# EAGLE design Team18_V1.3 (EAGLE 9.3.0)
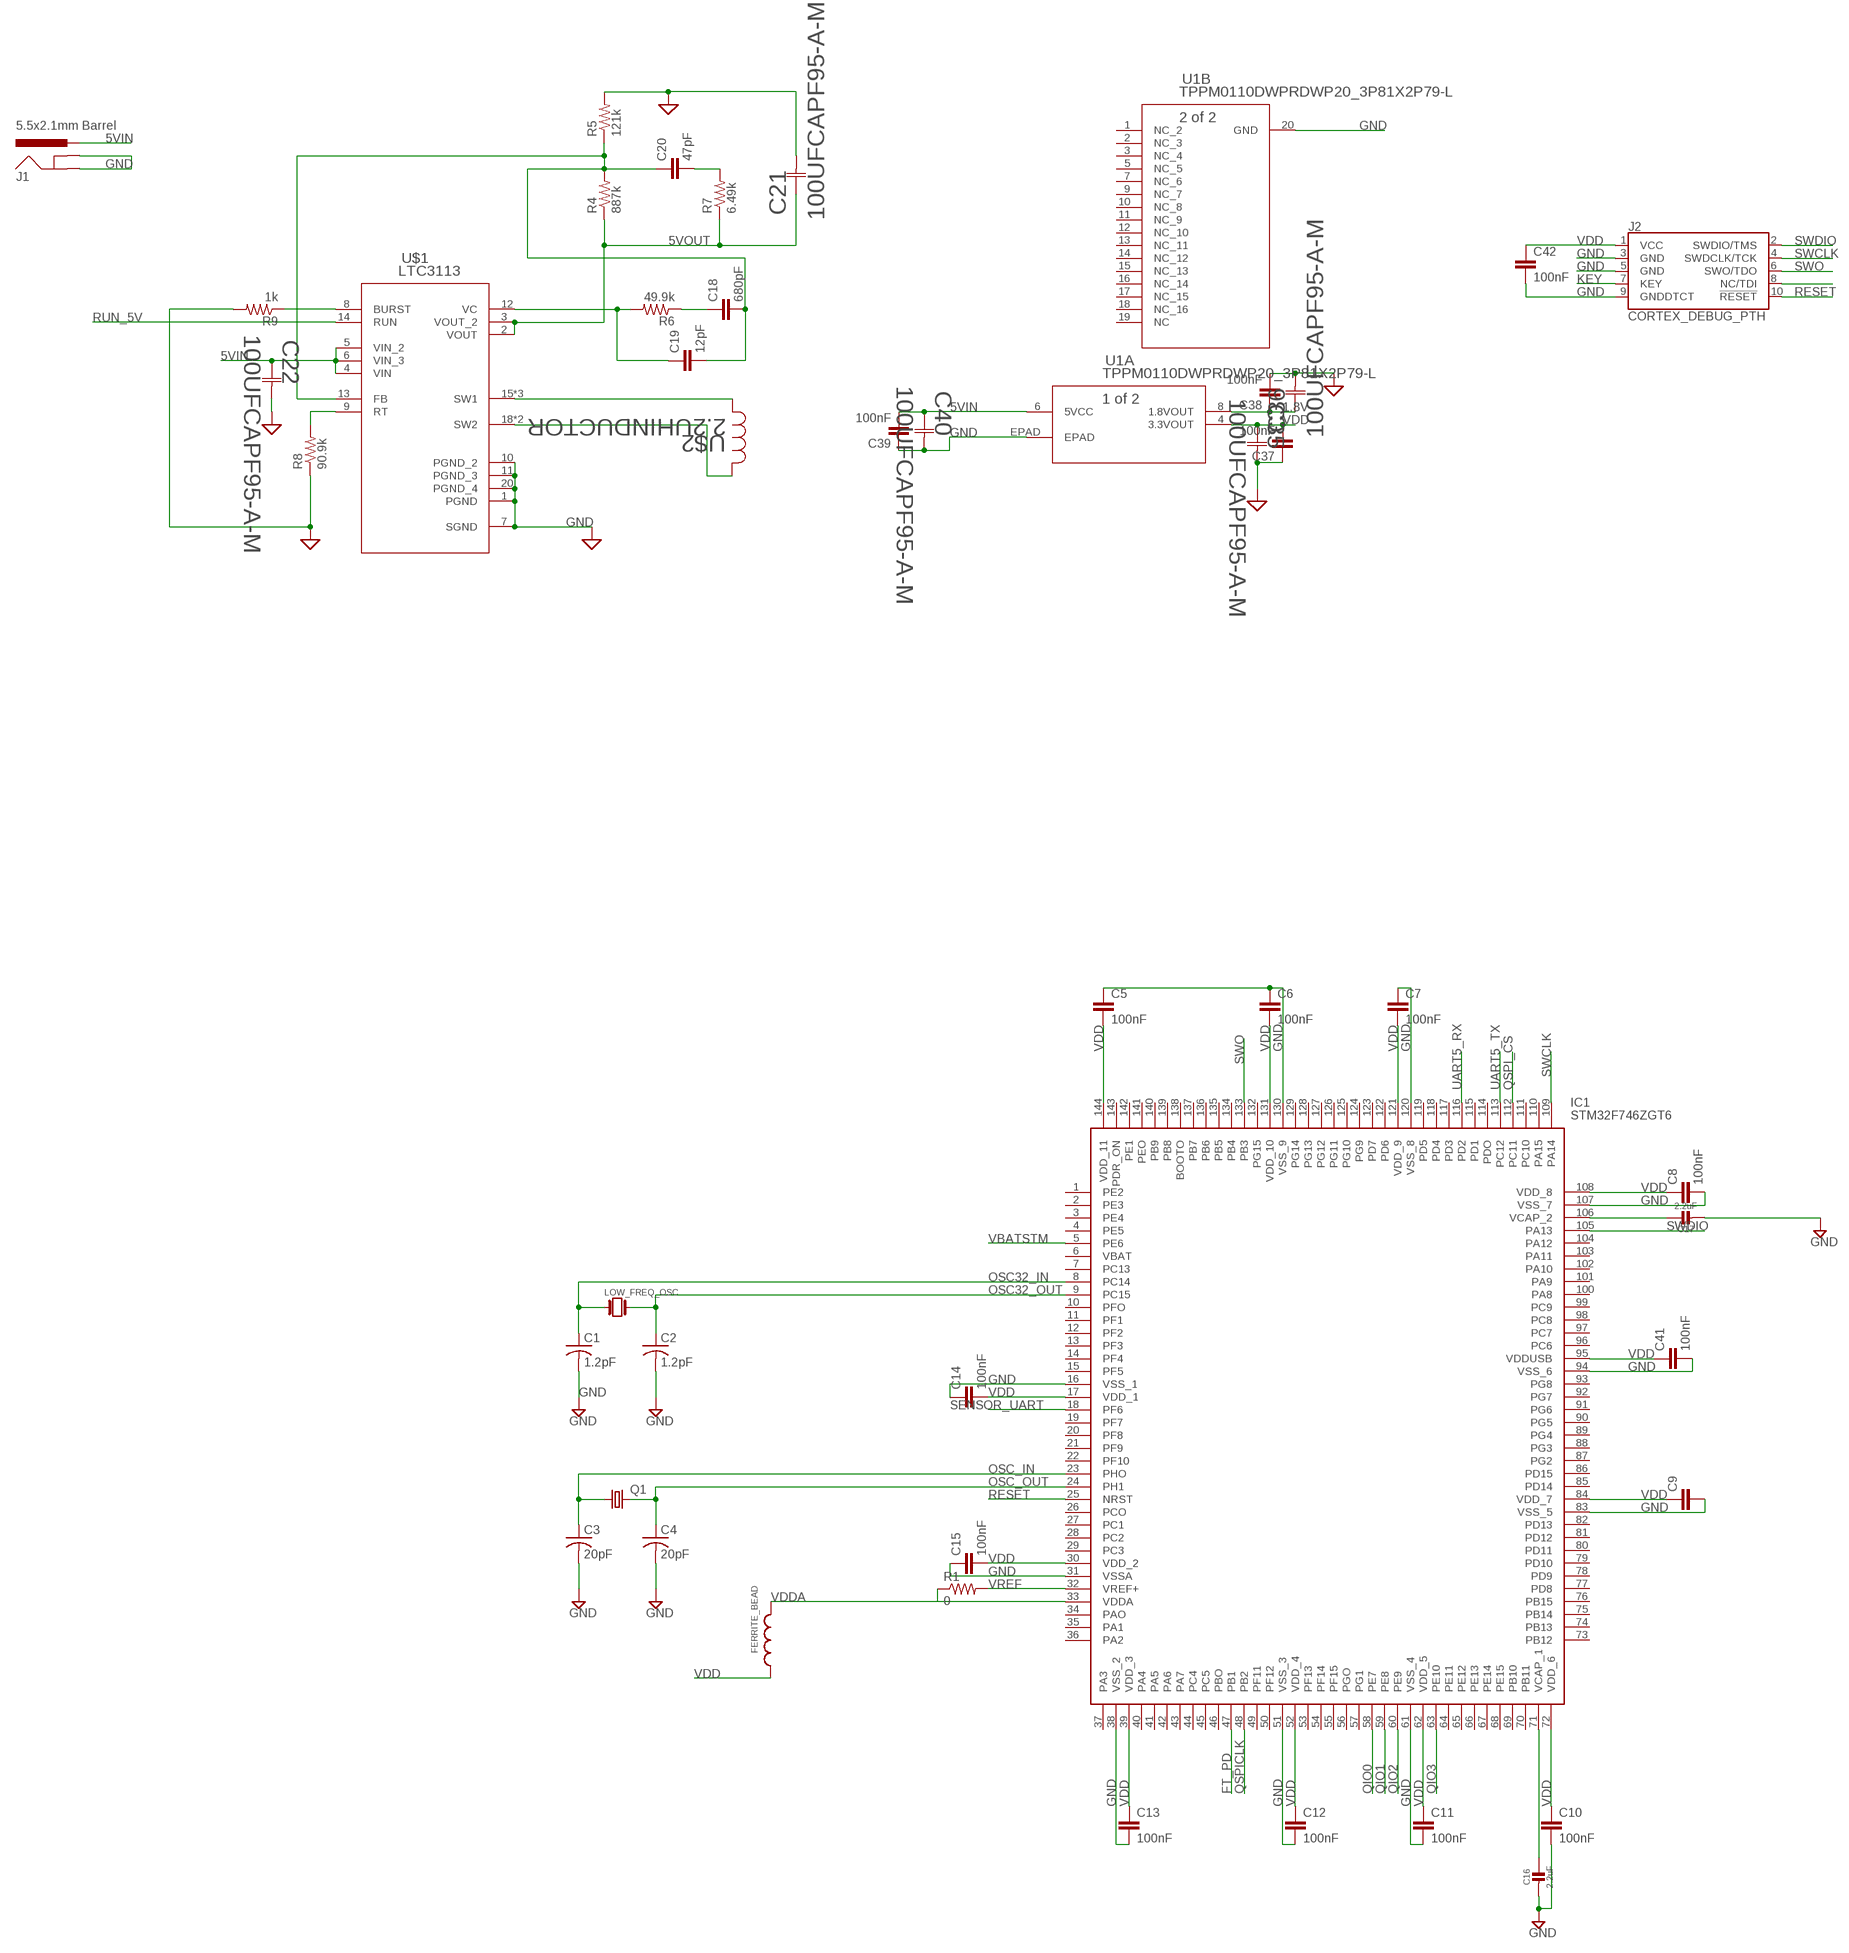
[diagram p0: schematic, sheet 1, part 1 of 2]
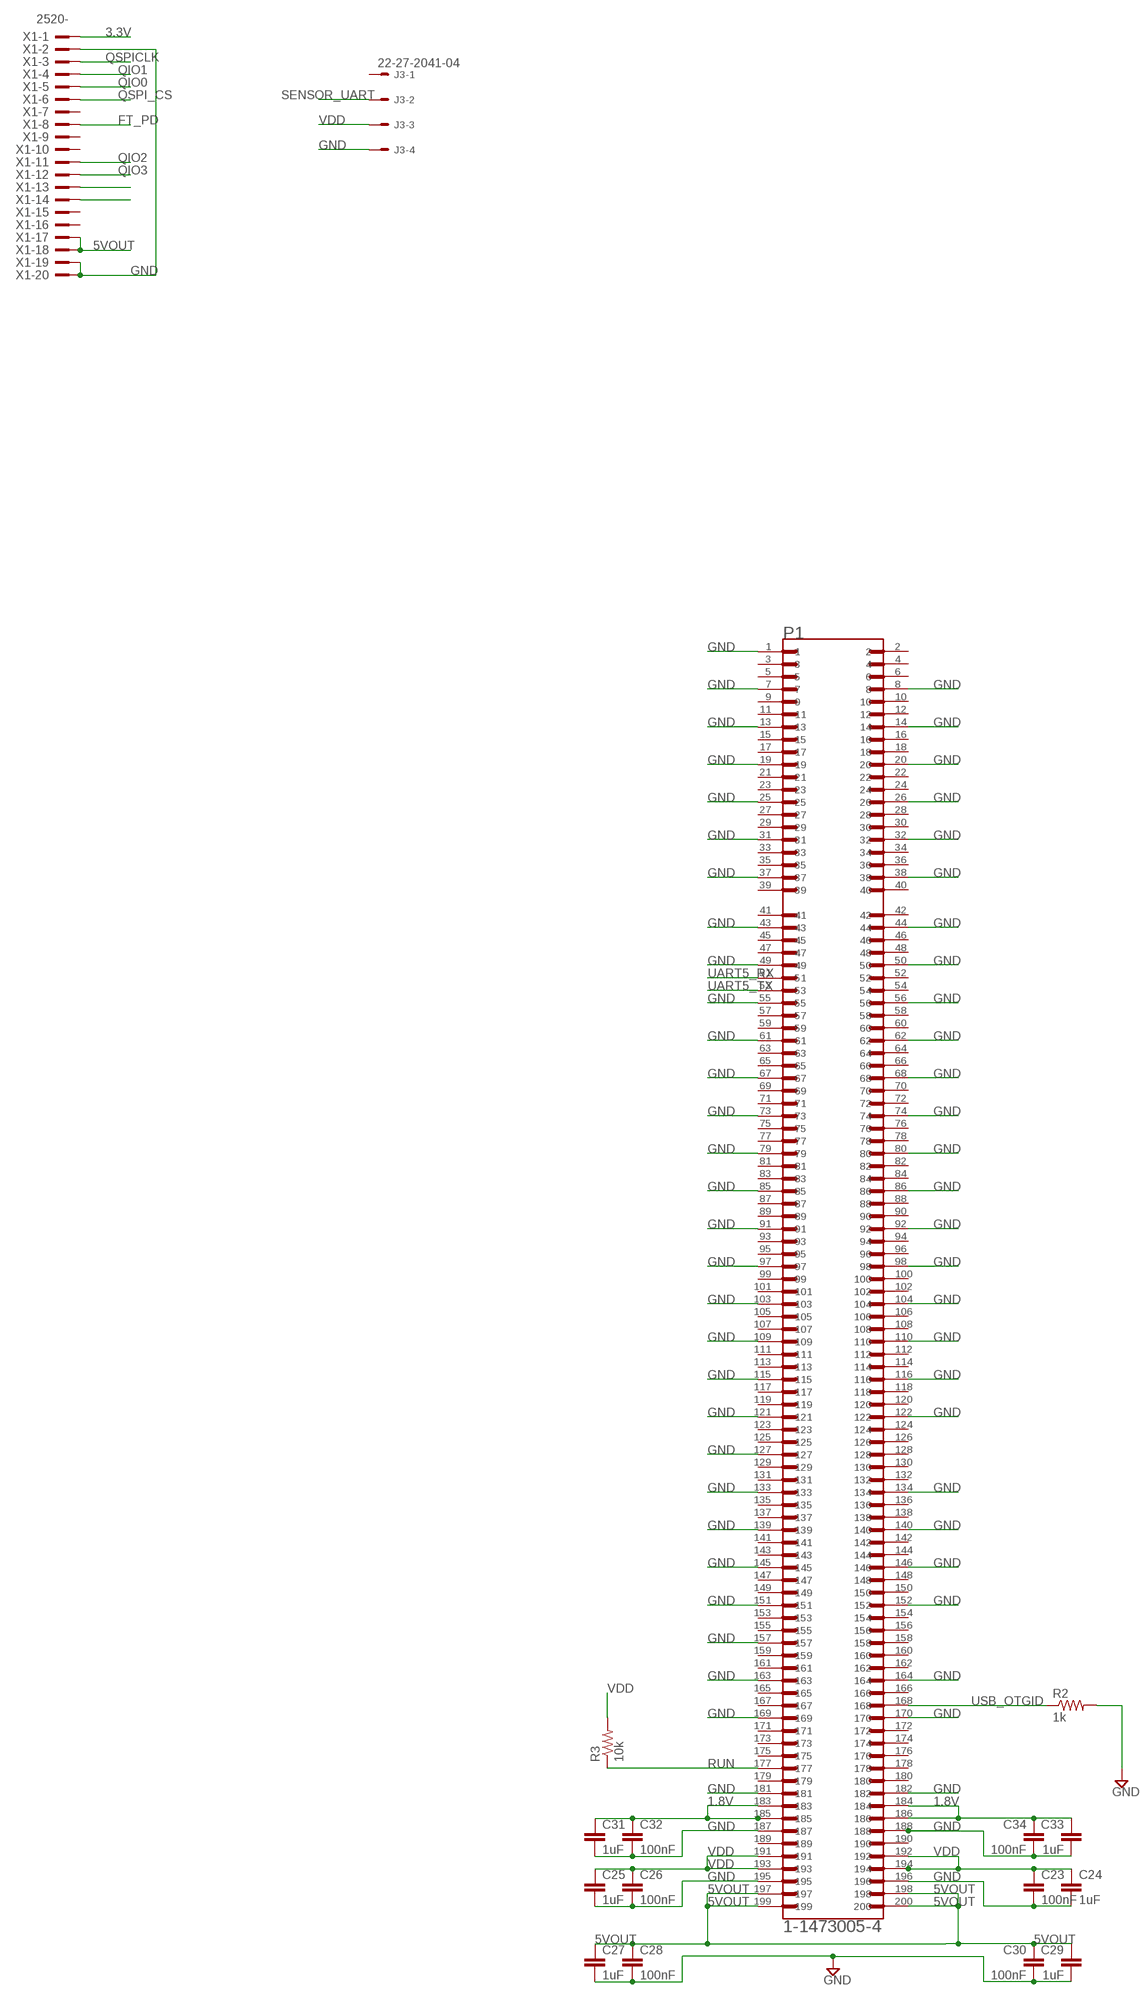
[diagram p1: schematic, sheet 1, part 2 of 2]

## Parts
C1  1.2pF  C-USC0805  [C0805]
C2  1.2pF  C-USC0805  [C0805]
C3  20pF  C-USC0805  [C0805]
C4  20pF  C-USC0805  [C0805]
C5  100nF  C-EUC0805  [C0805]
C6  100nF  C-EUC0805  [C0805]
C7  100nF  C-EUC0805  [C0805]
C8  100nF  C-EUC0805  [C0805]
C9  C-EUC0805  [C0805]
C10  100nF  C-EUC0805  [C0805]
C11  100nF  C-EUC0805  [C0805]
C12  100nF  C-EUC0805  [C0805]
C13  100nF  C-EUC0805  [C0805]
C14  100nF  C-EUC0805  [C0805]
C15  100nF  C-EUC0805  [C0805]
C16  2.2uF  CAP_CERAMIC0805-NOOUTLINE  [0805-NO]
C17  2.2uF  CAP_CERAMIC0805-NOOUTLINE  [0805-NO]
C18  680pF  C-EUC0805  [C0805]
C19  12pF  C-EUC0805  [C0805]
C20  47pF  C-EUC0805  [C0805]
C21  100UFCAPF95-A-M  [F95-A-M]
C22  100UFCAPF95-A-M  [F95-A-M]
C23  100nF  C-EUC0805  [C0805]
C24  1uF  C-EUC0805  [C0805]
C25  1uF  C-EUC0805  [C0805]
C26  100nF  C-EUC0805  [C0805]
C27  1uF  C-EUC0805  [C0805]
C28  100nF  C-EUC0805  [C0805]
C29  1uF  C-EUC0805  [C0805]
C30  100nF  C-EUC0805  [C0805]
C31  1uF  C-EUC0805  [C0805]
C32  100nF  C-EUC0805  [C0805]
C33  1uF  C-EUC0805  [C0805]
C34  100nF  C-EUC0805  [C0805]
C35  100UFCAPF95-A-M  [F95-A-M]
C36  100UFCAPF95-A-M  [F95-A-M]
C37  100nF  C-EUC0805  [C0805]
C38  100nF  C-EUC0805  [C0805]
C39  100nF  C-EUC0805  [C0805]
C40  100UFCAPF95-A-M  [F95-A-M]
C41  100nF  C-EUC0805  [C0805]
C42  100nF  C-EUC0805  [C0805]
FERRITE_BEAD  WE-CBA_0805_782853112_HC  [WE-CBA_0805(W=4)]
IC1  STM32F746ZGT6  [QFP50P2200X2200X160-144N]
J1  5.5x2.1mm Barrel  POWER_JACKSMD  [POWER_JACK_SMD]
J2  CORTEX_DEBUG_PTH  [2X5-PTH-1.27MM]
J3  22-27-2041-04  [6410-04]
LOW_FREQ_OSC  GENERIC-CRYSTAL_FC135  [FC135]
P1  1-1473005-4  [TE_1-1473005-4]
Q1  CRYSTALHC49UP  [HC49UP]
R1  0  R-US_R0805  [R0805]
R2  1k  R-US_R0805  [R0805]
R3  10k  R-US_R0805  [R0805]
R4  887k  R-US_R0805  [R0805]
R5  121k  R-US_R0805  [R0805]
R6  49.9k  R-US_R0805  [R0805]
R7  6.49k  R-US_R0805  [R0805]
R8  90.9k  R-US_R0805  [R0805]
R9  1k  R-US_R0805  [R0805]
U1  TPPM0110DWPRDWP20_3P81X2P79-L  [DWP20_3P81X2P79-L]
U$1  LTC3113  [TSSOP-20_FE/CA]
U$2  2.2UHINDUCTOR  [IND_10040]
X1  2520-  [PAK100/2500-20]

## Nets
1.8V: C31.1 C32.1 C33.1 C34.1 C36.1 C38.1 P1.183 P1.184 P1.185 P1.186 U1.8(A:1.8VOUT)
3.3V: X1.1
5VIN: C22.1 C39.2 C40.1 J1.VIN0(PWR) U1.6(A:5VCC) U$1.4(VIN) U$1.5(VIN_2) U$1.6(VIN_3)
5VOUT: C21.1 C27.1 C28.1 C29.1 C30.1 P1.197 P1.198 P1.199 P1.200 R4.1 R7.1 U$1.2(VOUT) U$1.3(VOUT_2) X1.17 X1.18
FT_PD: IC1.47(PB1) X1.8
GND: C1.2 C2.2 C3.2 C4.2 C5.1 C6.1 C7.1 C8.2 C9.2 C10.2 C11.2 C12.2 C13.2 C14.1 C15.1 C16.2 C17.2 C21.2 C22.2 C23.2 C24.2 C25.2 C26.2 C27.2 C28.2 C29.2 C30.2 C31.2 C32.2 C33.2 C34.2 C35.2 C36.2 C37.1 C38.2 C39.1 C40.2 C41.2 C42.2 IC1.16(VSS_1) IC1.31(VSSA) IC1.38(VSS_2) IC1.51(VSS_3) IC1.61(VSS_4) IC1.83(VSS_5) IC1.94(VSS_6) IC1.107(VSS_7) IC1.120(VSS_8) IC1.130(VSS_9) J1.GND(GNDBREAK) J1.P$4(GND) J2.3(GND) J2.5(GND) J2.9(GNDDTCT) J3.4 P1.1 P1.7 P1.8 P1.13 P1.14 P1.19 P1.20 P1.25 P1.26 P1.31 P1.32 P1.37 P1.38 P1.43 P1.44 P1.49 P1.50 P1.55 P1.56 P1.61 P1.62 P1.67 P1.68 P1.73 P1.74 P1.79 P1.80 P1.85 P1.86 P1.91 P1.92 P1.97 P1.98 P1.103 P1.104 P1.109 P1.110 P1.115 P1.116 P1.121 P1.122 P1.127 P1.133 P1.134 P1.139 P1.140 P1.145 P1.146 P1.151 P1.152 P1.157 P1.163 P1.164 P1.169 P1.170 P1.181 P1.182 P1.187 P1.188 P1.195 P1.196 R2.2 R5.2 R8.1 R9.2 U1.20(B:GND) U1.EPAD(A:EPAD) U$1.1(PGND) U$1.7(SGND) U$1.10(PGND_2) U$1.11(PGND_3) U$1.20(PGND_4) X1.2 X1.19 X1.20 ; supply symbol labelled SUP
KEY: J2.7(KEY)
N$1: C16.1 IC1.71(VCAP_1)
N$2: C17.1 IC1.106(VCAP_2)
N$3: C20.2 R7.2
N$4: C19.1 R6.2 U$1.12(VC)
N$5: C18.1 R6.1
N$6: C18.2 C19.2 C20.1 R4.2 R5.1 U$1.13(FB)
N$7: U$1.15(SW1) U$1.16(SW1) U$1.17(SW1) U$2.2
N$8: U$1.18(SW2) U$1.19(SW2) U$2.1
N$9: R8.2 U$1.9(RT)
N$10: R9.1 U$1.8(BURST)
N$19: J2.8(NC/TDI)
N$20: X1.13
N$21: X1.14
OSC32_IN: C1.1 IC1.8(PC14) LOW_FREQ_OSC.X1
OSC32_OUT: C2.1 IC1.9(PC15) LOW_FREQ_OSC.X2
OSC_IN: C3.1 IC1.23(PHO) Q1.1
OSC_OUT: C4.1 IC1.24(PH1) Q1.2
QIO0: IC1.58(PE7) X1.5
QIO1: IC1.59(PE8) X1.4
QIO2: IC1.60(PE9) X1.11
QIO3: IC1.63(PE10) X1.12
QSPI_CS: IC1.112(PC11) X1.6
QSPICLK: IC1.48(PB2) X1.3
RESET: IC1.25(NRST) J2.10(!RESET)
RUN: P1.177 R3.1
RUN_5V: U$1.14(RUN)
SENSOR_UART: IC1.18(PF6) J3.2
SWCLK: IC1.109(PA14) J2.4(SWDCLK/TCK)
SWDIO: IC1.105(PA13) J2.2(SWDIO/TMS)
SWO: IC1.133(PB3) J2.6(SWO/TDO)
UART5_RX: IC1.116(PD2) P1.51
UART5_TX: IC1.113(PC12) P1.53
USB_OTGID: P1.168 R2.1
VBATSTM: IC1.5(PE6)
VDD: C5.2 C6.2 C7.2 C8.1 C9.1 C10.1 C11.1 C12.1 C13.1 C14.2 C15.2 C23.1 C24.1 C25.1 C26.1 C35.1 C37.2 C41.1 C42.1 FERRITE_BEAD.1 IC1.17(VDD_1) IC1.30(VDD_2) IC1.39(VDD_3) IC1.52(VDD_4) IC1.62(VDD_5) IC1.72(VDD_6) IC1.84(VDD_7) IC1.95(VDDUSB) IC1.108(VDD_8) IC1.121(VDD_9) IC1.131(VDD_10) IC1.144(VDD_11) J2.1(VCC) J3.3 P1.191 P1.192 P1.193 P1.194 R3.2 U1.4(A:3.3VOUT)
VDDA: FERRITE_BEAD.2 IC1.33(VDDA) R1.1
VREF: IC1.32(VREF+) R1.2
Unconnected: IC1.1(PE2) IC1.2(PE3) IC1.3(PE4) IC1.4(PE5) IC1.6(VBAT) IC1.7(PC13) IC1.10(PFO) IC1.11(PF1) IC1.12(PF2) IC1.13(PF3) IC1.14(PF4) IC1.15(PF5) IC1.19(PF7) IC1.20(PF8) IC1.21(PF9) IC1.22(PF10) IC1.26(PCO) IC1.27(PC1) IC1.28(PC2) IC1.29(PC3) IC1.34(PAO) IC1.35(PA1) IC1.36(PA2) IC1.37(PA3) IC1.40(PA4) IC1.41(PA5) IC1.42(PA6) IC1.43(PA7) IC1.44(PC4) IC1.45(PC5) IC1.46(PBO) IC1.49(PF11) IC1.50(PF12) IC1.53(PF13) IC1.54(PF14) IC1.55(PF15) IC1.56(PGO) IC1.57(PG1) IC1.64(PE11) IC1.65(PE12) IC1.66(PE13) IC1.67(PE14) IC1.68(PE15) IC1.69(PB10) IC1.70(PB11) IC1.73(PB12) IC1.74(PB13) IC1.75(PB14) IC1.76(PB15) IC1.77(PD8) IC1.78(PD9) IC1.79(PD10) IC1.80(PD11) IC1.81(PD12) IC1.82(PD13) IC1.85(PD14) IC1.86(PD15) IC1.87(PG2) IC1.88(PG3) IC1.89(PG4) IC1.90(PG5) IC1.91(PG6) IC1.92(PG7) IC1.93(PG8) IC1.96(PC6) IC1.97(PC7) IC1.98(PC8) IC1.99(PC9) IC1.100(PA8) IC1.101(PA9) IC1.102(PA10) IC1.103(PA11) IC1.104(PA12) IC1.110(PA15) IC1.111(PC10) IC1.114(PDO) IC1.115(PD1) IC1.117(PD3) IC1.118(PD4) IC1.119(PD5) IC1.122(PD6) IC1.123(PD7) IC1.124(PG9) IC1.125(PG10) IC1.126(PG11) IC1.127(PG12) IC1.128(PG13) IC1.129(PG14) IC1.132(PG15) IC1.134(PB4) IC1.135(PB5) IC1.136(PB6) IC1.137(PB7) IC1.138(BOOTO) IC1.139(PB8) IC1.140(PB9) IC1.141(PEO) IC1.142(PE1) IC1.143(PDR_ON) J3.1 P1.2 P1.3 P1.4 P1.5 P1.6 P1.9 P1.10 P1.11 P1.12 P1.15 P1.16 P1.17 P1.18 P1.21 P1.22 P1.23 P1.24 P1.27 P1.28 P1.29 P1.30 P1.33 P1.34 P1.35 P1.36 P1.39 P1.40 P1.41 P1.42 P1.45 P1.46 P1.47 P1.48 P1.52 P1.54 P1.57 P1.58 P1.59 P1.60 P1.63 P1.64 P1.65 P1.66 P1.69 P1.70 P1.71 P1.72 P1.75 P1.76 P1.77 P1.78 P1.81 P1.82 P1.83 P1.84 P1.87 P1.88 P1.89 P1.90 P1.93 P1.94 P1.95 P1.96 P1.99 P1.100 P1.101 P1.102 P1.105 P1.106 P1.107 P1.108 P1.111 P1.112 P1.113 P1.114 P1.117 P1.118 P1.119 P1.120 P1.123 P1.124 P1.125 P1.126 P1.128 P1.129 P1.130 P1.131 P1.132 P1.135 P1.136 P1.137 P1.138 P1.141 P1.142 P1.143 P1.144 P1.147 P1.148 P1.149 P1.150 P1.153 P1.154 P1.155 P1.156 P1.158 P1.159 P1.160 P1.161 P1.162 P1.165 P1.166 P1.167 P1.171 P1.172 P1.173 P1.174 P1.175 P1.176 P1.178 P1.179 P1.180 P1.189 P1.190 U1.1(B:NC_2) U1.2(B:NC_3) U1.3(B:NC_4) U1.5(B:NC_5) U1.7(B:NC_6) U1.9(B:NC_7) U1.10(B:NC_8) U1.11(B:NC_9) U1.12(B:NC_10) U1.13(B:NC_11) U1.14(B:NC_12) U1.15(B:NC_13) U1.16(B:NC_14) U1.17(B:NC_15) U1.18(B:NC_16) U1.19(B:NC) X1.7 X1.9 X1.10 X1.15 X1.16

## Library data of the parts
C1-C4 = adafruit:C-US: CAPACITOR, American symbol
C5-C15 C18-C20 C23-C34 C37-C39 C41 C42 = rcl:C-EU: CAPACITOR, European symbol; SPICEPREFIX: C
C16 C17 = audio amplifier example:CAP_CERAMIC
C21 C22 C35 C36 C40 = 477_LIBRARY:100UFCAP; MANUFACTURER_PART_NUMBER: F951A107KAAAQ2; VENDOR: AVX Corporation
FERRITE_BEAD = Wurth_Elektronik_Passive_rev18f:WE-CBA_0805: WE-CBA SMD EMI Suppression Ferrite Bead Characteristics Reliable Ni-Sn electrodes High rated current up to 5A Recommended soldering: Reflow Operating temperature: -55°C to +125°C Applications * Perfect as data line filter and for uncoupling of distribution voltage *This special SMD chip bead ferrites can be put directly on the printed circuit board. They offer excellent anti-EMI properties and low DC-resistance. Placed very close next to the interference source even with smallest size 0402,maximal impedance at 1000 Ω can be reached. *High Speed: "High Speed " SMD ferrites WE-CBF have lower impedance in the lower frequency ranges thus they have only a low attenuation for fast signals. Application e.g. USB 2.0, IEEE 1394,LVDS *Wide Band: "Wide Band" SMD ferrites WE-CBF already show high impedance in low frequency range. Therefore they are wide band through the whole spectrum. Application e.g. control signats, RS232, RS422, DC/DC converter *High Current: "High Current " SMD ferrites WE-CBF are designed for high current (over 1 A). The rated current refers to 40K self-heating. High current SMD ferrites are available in all there types (High Speed, Wide Band and High Frequency). Application e.g. power supply, DC/DC converter *Advice: Pay attention for the use of SMD-Ferrites for high current>1A and ambient temperature over +85°C that the rated current has to be reduced when temperature is above +85°C (Derating). *At+100°C environment temperature the maximal rated current has to add up to only 60% of the data sheet value ,without an overload of the component. Variant abbreviation WB means WIDE BAND HS means HIGH SPEED HC means HIGH CURRENT <http://katalog.we-online.de/media/images/v2/Family_WE-CBA.jpg> Details see: http://katalog.we-online.de/en/pbs/WE-CBA/ Created: 2015-02-02 2015 (C) Wurth Elektronik
IC1 = 477_LIBRARY:STM32F746ZGT6: ARM Microcontrollers - MCU High-performance and DSP with FPU, ARM Cortex-M7 MCU with 1 Mbytes Flash, 200 MHz CPU, Art Accelerator, L1 cache, SDRAM Source: Datasheet <http://docs-emea.rs-online.com/webdocs/13fb/0900766b813fbe9b.pdf>; DESCRIPTION: ARM Microcontrollers - MCU High-performance and DSP with FPU, ARM Cortex-M7 MCU with 1 Mbytes Flash, 200 MHz CPU, Art Accelerator, L1 cache, SDRAM; HEIGHT: 1.6mm; MANUFACTURER_NAME: STMicroelectronics; MANUFACTURER_PART_NUMBER: STM32F746ZGT6; MOUSER_PART_NUMBER: 511-STM32F746ZGT6; MOUSER_PRICE-STOCK: https://www.mouser.com/Search/Refine.aspx?Keyword=511-STM32F746ZGT6; RS_PART_NUMBER: 8820290; RS_PRICE-STOCK: http://uk.rs-online.com/web/p/products/8820290
J1 = SparkFun-Connectors:POWER_JACK: Power Jack Connector This is the standard 5.5mm barrel jack for power. The PTH is the most common, proven, reliable, footprint. The Slot footprint only works if the mill layer is transmitted to the PCB fab house so be warned. Here are the connectors we sell at SparkFun: DC Barrel Power Jack/Connector <https://www.sparkfun.com/products/119> (PRT-00119) DC Barrel Power Jack/Connector (SMD) <https://www.sparkfun.com/products/12748> (PRT-12748) DC Barrel Jack Adapter - Breadboard Compatible <https://www.sparkfun.com/products/10811> (PRT-10811) It is used on this SparkFun product (and many, many others): SparkFun RedBoard - Programmed with Arduino <https://www.sparkfun.com/products/12757> (DEV-12757) Also, if you need a mating power supply or connector, please check these out: Wall Adapter Power Supply - 9VDC 650mA <https://www.sparkfun.com/products/298> (TOL-00298) DC Barrel Jack Adapter - Male <https://www.sparkfun.com/products/10287> (PRT-10287); PROD_ID: CONN-08106; SF_ID: PRT-12748
J2 = SparkFun-Connectors:CORTEX_DEBUG: Cortex Debug Connector - 10 pin Supports JTAG debug, Serial Wire debug, and Serial Wire Viewer. PTH and SMD connector options available. General Connector Information <http://infocenter.arm.com/help/topic/com.arm.doc.faqs/attached/13634/cortex_debug_connectors.pdf> Products: PTH Connector <http://www.digikey.com/product-detail/en/cnc-tech/3220-10-0100-00/1175-1627-ND/3883661> -via Digi-Key SparkFun PSoc <https://www.sparkfun.com/products/13229> SparkFun T <https://www.sparkfun.com/products/13810>
J3 = con-molex:22-?-04: CONNECTOR wire to board 2.54 mm (.1 inch) pitch header; MF: MOLEX; OC_FARNELL: unknown; OC_NEWARK: unknown
LOW_FREQ_OSC = mbed-HDK-Oscillator:GENERIC-CRYSTAL: GENERIC Crystal
P1 = Rpi-DDR2:1-1473005-4: Conn SO DIMM Socket SKT 200 POS 0.6mm Solder RA SMD Tray; AVAILABILITY: Unavailable; CENTERLINE_PITCH: .6 mm[.024 in]; COMMENT: 1-1473005-4; DESCRIPTION: SEMI-HARD TRAY DDR2 SODIMM SOCKET 200P 5; MF: TE Connectivity; MP: 1-1473005-4; NUMBER_OF_POSITIONS: 200; PACKAGE: None; PRICE: None; PRODUCT_TYPE: Socket; TE_PURCHASE_URL: https://www.te.com/usa-en/product-1-1473005-4.html?te_bu=Cor&te_type=disp&te_campaign=seda_glo_cor-seda-global-disp-prtnr-fy19-seda-model-bom-cta_sma-317_1&elqCampaignId=32493
Q1 = adafruit:CRYSTAL: CRYSTAL; OC_FARNELL: unknown; OC_NEWARK: unknown
R1-R3 = audio amplifier example:R-US_: RESISTOR, American symbol
R4-R9 = resistor:R-US_: RESISTOR, American symbol
U1 = 477_LIBRARY:TPPM0110DWPR; MANUFACTURER_PART_NUMBER: TPPM0110DWPR; VENDOR: Texas Instruments
U$1 = 477_LIBRARY:LTC3113
U$2 = 477_LIBRARY:2.2UHINDUCTOR
X1 = con-3m:2520-: 3M (TM) Pak 100 4-Wall Header Source: 3M; OC_FARNELL: unknown; OC_NEWARK: unknown

## Board
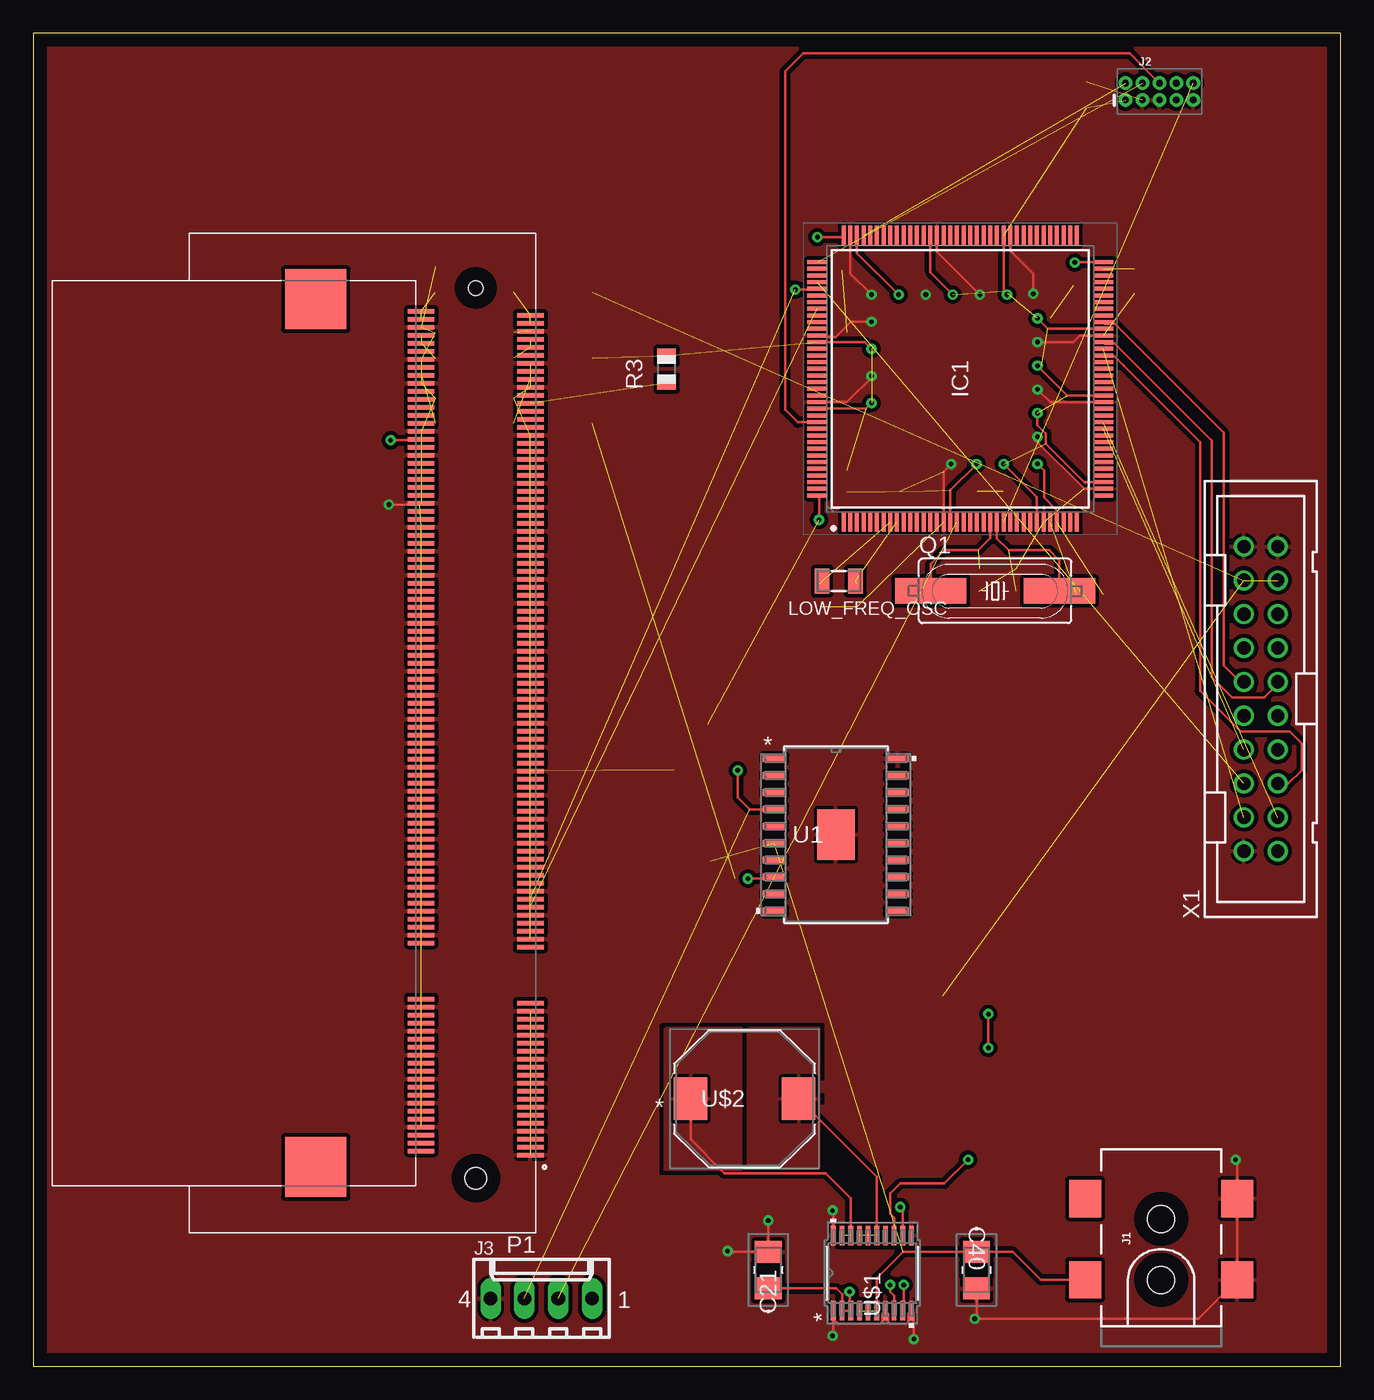
[diagram p2: board, top side]
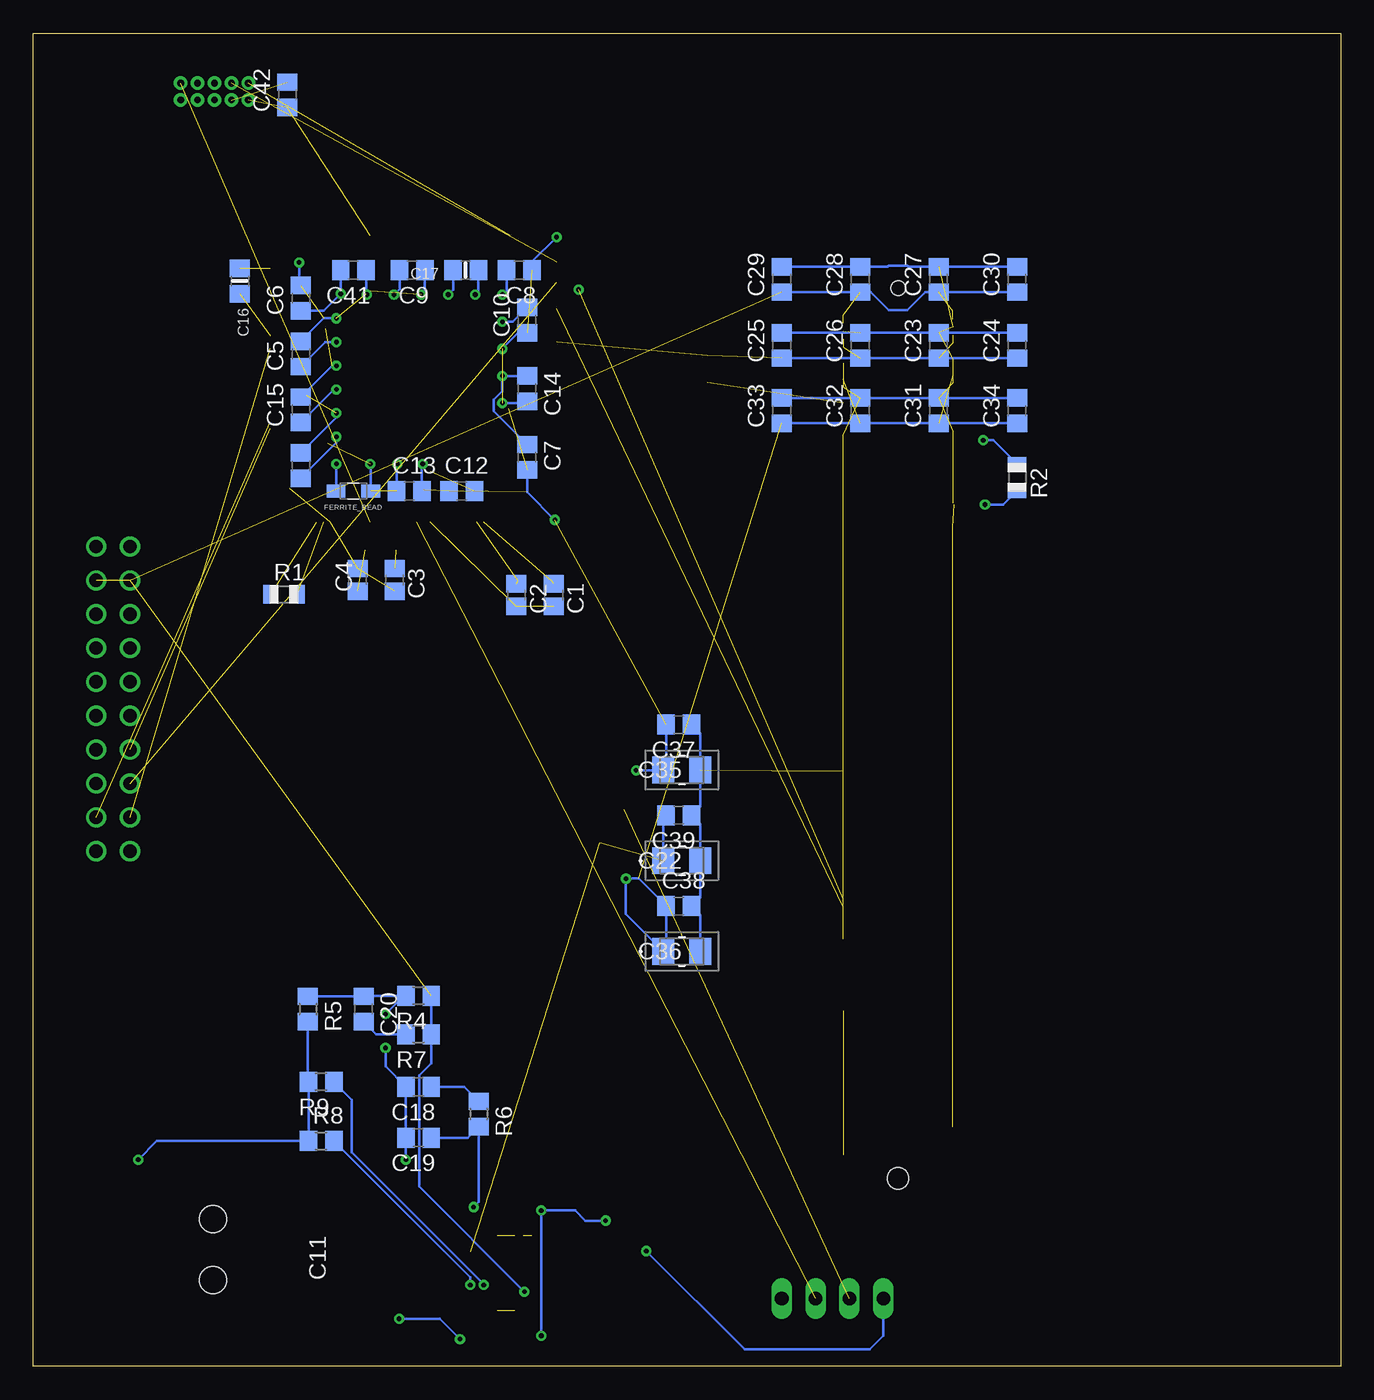
[diagram p3: board, bottom side, seen from below]

Size 98.04 x 100 mm. Coordinates in mm from the lower left corner, seen from the top.
Outline: 0,0 98.04,0 98.04,100 0,100 0,0
Copper layers (1*16): Top 0.035mm / dielectric 1.5mm / Bottom 0.035mm
Design rules "default": minimum track width 6mil, minimum drill 0.35mm, track to track 6mil, track to pad 6mil, pad to pad 6mil, via to via 6mil, smd to smd 6mil, copper to edge 40mil, drill to drill 6mil, minimum pad ring 10mil, minimum via ring 8mil, stop-mask expansion 4mil, vias tented up to drill 0mil, thermal gap 10mil

### Footprints (pad centres in the part's own frame; a part is rotated, then mirrored left to right if it is on the bottom)
C0805 = smd 1.3 x 1.5: 1 -0.85,0; 2 0.85,0
C0805' = smd 1.3 x 1.5: 1 -0.95,0; 2 0.95,0
0805-NO = smd 1.3 x 1.5: 1 -0.95,0; 2 0.95,0
F95-A-M = smd 1.651 x 2.007: 1 -1.384,0; 2 1.384,0
WE-CBA_0805(W=4) = smd 1.4 x 1: 1 -1.3,0; 2 1.3,0
QFP50P2200X2200X160-144N = smd 1.475 x 0.3: 1 -10.738,8.75; 2 -10.738,8.25; 3 -10.738,7.75; 4 -10.738,7.25; 5 -10.738,6.75; 6 -10.738,6.25; 7 -10.738,5.75; 8 -10.738,5.25; 9 -10.738,4.75; 10 -10.738,4.25; 11 -10.738,3.75; 12 -10.738,3.25; 13 -10.738,2.75; 14 -10.738,2.25; 15 -10.738,1.75; 16 -10.738,1.25; 17 -10.738,0.75; 18 -10.738,0.25; 19 -10.738,-0.25; 20 -10.738,-0.75; 21 -10.738,-1.25; 22 -10.738,-1.75; 23 -10.738,-2.25; 24 -10.738,-2.75; 25 -10.738,-3.25; 26 -10.738,-3.75; 27 -10.738,-4.25; 28 -10.738,-4.75; 29 -10.738,-5.25; 30 -10.738,-5.75; 31 -10.738,-6.25; 32 -10.738,-6.75; 33 -10.738,-7.25; 34 -10.738,-7.75; 35 -10.738,-8.25; 36 -10.738,-8.75; 73 10.738,-8.75; 74 10.738,-8.25; 75 10.738,-7.75; 76 10.738,-7.25; 77 10.738,-6.75; 78 10.738,-6.25; 79 10.738,-5.75; 80 10.738,-5.25; 81 10.738,-4.75; 82 10.738,-4.25; 83 10.738,-3.75; 84 10.738,-3.25; 85 10.738,-2.75; 86 10.738,-2.25; 87 10.738,-1.75; 88 10.738,-1.25; 89 10.738,-0.75; 90 10.738,-0.25; 91 10.738,0.25; 92 10.738,0.75; 93 10.738,1.25; 94 10.738,1.75; 95 10.738,2.25; 96 10.738,2.75; 97 10.738,3.25; 98 10.738,3.75; 99 10.738,4.25; 100 10.738,4.75; 101 10.738,5.25; 102 10.738,5.75; 103 10.738,6.25; 104 10.738,6.75; 105 10.738,7.25; 106 10.738,7.75; 107 10.738,8.25; 108 10.738,8.75 | smd 0.3 x 1.475: 37 -8.75,-10.738; 38 -8.25,-10.738; 39 -7.75,-10.738; 40 -7.25,-10.738; 41 -6.75,-10.738; 42 -6.25,-10.738; 43 -5.75,-10.738; 44 -5.25,-10.738; 45 -4.75,-10.738; 46 -4.25,-10.738; 47 -3.75,-10.738; 48 -3.25,-10.738; 49 -2.75,-10.738; 50 -2.25,-10.738; 51 -1.75,-10.738; 52 -1.25,-10.738; 53 -0.75,-10.738; 54 -0.25,-10.738; 55 0.25,-10.738; 56 0.75,-10.738; 57 1.25,-10.738; 58 1.75,-10.738; 59 2.25,-10.738; 60 2.75,-10.738; 61 3.25,-10.738; 62 3.75,-10.738; 63 4.25,-10.738; 64 4.75,-10.738; 65 5.25,-10.738; 66 5.75,-10.738; 67 6.25,-10.738; 68 6.75,-10.738; 69 7.25,-10.738; 70 7.75,-10.738; 71 8.25,-10.738; 72 8.75,-10.738; 109 8.75,10.738; 110 8.25,10.738; 111 7.75,10.738; 112 7.25,10.738; 113 6.75,10.738; 114 6.25,10.738; 115 5.75,10.738; 116 5.25,10.738; 117 4.75,10.738; 118 4.25,10.738; 119 3.75,10.738; 120 3.25,10.738; 121 2.75,10.738; 122 2.25,10.738; 123 1.75,10.738; 124 1.25,10.738; 125 0.75,10.738; 126 0.25,10.738; 127 -0.25,10.738; 128 -0.75,10.738; 129 -1.25,10.738; 130 -1.75,10.738; 131 -2.25,10.738; 132 -2.75,10.738; 133 -3.25,10.738; 134 -3.75,10.738; 135 -4.25,10.738; 136 -4.75,10.738; 137 -5.25,10.738; 138 -5.75,10.738; 139 -6.25,10.738; 140 -6.75,10.738; 141 -7.25,10.738; 142 -7.75,10.738; 143 -8.25,10.738; 144 -8.75,10.738
POWER_JACK_SMD = smd 2.8 x 2.4: GND 0,-5.7; P$4 6.1,-5.7; VIN0 0,5.7; VIN1 6.1,5.7 | hole 2.032: 0,0; 4.572,0
2X5-PTH-1.27MM = drill 0.508 pad 1: 1 -2.54,-0.635; 2 -2.54,0.635; 3 -1.27,-0.635; 4 -1.27,0.635; 5 0,-0.635; 6 0,0.635; 7 1.27,-0.635; 8 1.27,0.635; 9 2.54,-0.635; 10 2.54,0.635
6410-04 = drill 1.016 long: 1 3.81,0; 2 1.27,0; 3 -1.27,0; 4 -3.81,0
FC135 = smd 1.1 x 1.9: X1 -1.25,0; X2 1.25,0
TE_1-1473005-4 = smd 2 x 0.35: 1 -4.1,31.65; 2 4.1,31.35; 3 -4.1,31.05; 4 4.1,30.75; 5 -4.1,30.45; 6 4.1,30.15; 7 -4.1,29.85; 8 4.1,29.55; 9 -4.1,29.25; 10 4.1,28.95; 11 -4.1,28.65; 12 4.1,28.35; 13 -4.1,28.05; 14 4.1,27.75; 15 -4.1,27.45; 16 4.1,27.15; 17 -4.1,26.85; 18 4.1,26.55; 19 -4.1,26.25; 20 4.1,25.95; 21 -4.1,25.65; 22 4.1,25.35; 23 -4.1,25.05; 24 4.1,24.75; 25 -4.1,24.45; 26 4.1,24.15; 27 -4.1,23.85; 28 4.1,23.55; 29 -4.1,23.25; 30 4.1,22.95; 31 -4.1,22.65; 32 4.1,22.35; 33 -4.1,22.05; 34 4.1,21.75; 35 -4.1,21.45; 36 4.1,21.15; 37 -4.1,20.85; 38 4.1,20.55; 39 -4.1,20.25; 40 4.1,19.95; 41 -4.1,16.05; 42 4.1,15.75; 43 -4.1,15.45; 44 4.1,15.15; 45 -4.1,14.85; 46 4.1,14.55; 47 -4.1,14.25; 48 4.1,13.95; 49 -4.1,13.65; 50 4.1,13.35; 51 -4.1,13.05; 52 4.1,12.75; 53 -4.1,12.45; 54 4.1,12.15; 55 -4.1,11.85; 56 4.1,11.55; 57 -4.1,11.25; 58 4.1,10.95; 59 -4.1,10.65; 60 4.1,10.35; 61 -4.1,10.05; 62 4.1,9.75; 63 -4.1,9.45; 64 4.1,9.15; 65 -4.1,8.85; 66 4.1,8.55; 67 -4.1,8.25; 68 4.1,7.95; 69 -4.1,7.65; 70 4.1,7.35; 71 -4.1,7.05; 72 4.1,6.75; 73 -4.1,6.45; 74 4.1,6.15; 75 -4.1,5.85; 76 4.1,5.55; 77 -4.1,5.25; 78 4.1,4.95; 79 -4.1,4.65; 80 4.1,4.35; 81 -4.1,4.05; 82 4.1,3.75; 83 -4.1,3.45; 84 4.1,3.15; 85 -4.1,2.85; 86 4.1,2.55; 87 -4.1,2.25; 88 4.1,1.95; 89 -4.1,1.65; 90 4.1,1.35; 91 -4.1,1.05; 92 4.1,0.75; 93 -4.1,0.45; 94 4.1,0.15; 95 -4.1,-0.15; 96 4.1,-0.45; 97 -4.1,-0.75; 98 4.1,-1.05; 99 -4.1,-1.35; 100 4.1,-1.65; 101 -4.1,-1.95; 102 4.1,-2.25; 103 -4.1,-2.55; 104 4.1,-2.85; 105 -4.1,-3.15; 106 4.1,-3.45; 107 -4.1,-3.75; 108 4.1,-4.05; 109 -4.1,-4.35; 110 4.1,-4.65; 111 -4.1,-4.95; 112 4.1,-5.25; 113 -4.1,-5.55; 114 4.1,-5.85; 115 -4.1,-6.15; 116 4.1,-6.45; 117 -4.1,-6.75; 118 4.1,-7.05; 119 -4.1,-7.35; 120 4.1,-7.65; 121 -4.1,-7.95; 122 4.1,-8.25; 123 -4.1,-8.55; 124 4.1,-8.85; 125 -4.1,-9.15; 126 4.1,-9.45; 127 -4.1,-9.75; 128 4.1,-10.05; 129 -4.1,-10.35; 130 4.1,-10.65; 131 -4.1,-10.95; 132 4.1,-11.25; 133 -4.1,-11.55; 134 4.1,-11.85; 135 -4.1,-12.15; 136 4.1,-12.45; 137 -4.1,-12.75; 138 4.1,-13.05; 139 -4.1,-13.35; 140 4.1,-13.65; 141 -4.1,-13.95; 142 4.1,-14.25; 143 -4.1,-14.55; 144 4.1,-14.85; 145 -4.1,-15.15; 146 4.1,-15.45; 147 -4.1,-15.75; 148 4.1,-16.05; 149 -4.1,-16.35; 150 4.1,-16.65; 151 -4.1,-16.95; 152 4.1,-17.25; 153 -4.1,-17.55; 154 4.1,-17.85; 155 -4.1,-18.15; 156 4.1,-18.45; 157 -4.1,-18.75; 158 4.1,-19.05; 159 -4.1,-19.35; 160 4.1,-19.65; 161 -4.1,-19.95; 162 4.1,-20.25; 163 -4.1,-20.55; 164 4.1,-20.85; 165 -4.1,-21.15; 166 4.1,-21.45; 167 -4.1,-21.75; 168 4.1,-22.05; 169 -4.1,-22.35; 170 4.1,-22.65; 171 -4.1,-22.95; 172 4.1,-23.25; 173 -4.1,-23.55; 174 4.1,-23.85; 175 -4.1,-24.15; 176 4.1,-24.45; 177 -4.1,-24.75; 178 4.1,-25.05; 179 -4.1,-25.35; 180 4.1,-25.65; 181 -4.1,-25.95; 182 4.1,-26.25; 183 -4.1,-26.55; 184 4.1,-26.85; 185 -4.1,-27.15; 186 4.1,-27.45; 187 -4.1,-27.75; 188 4.1,-28.05; 189 -4.1,-28.35; 190 4.1,-28.65; 191 -4.1,-28.95; 192 4.1,-29.25; 193 -4.1,-29.55; 194 4.1,-29.85; 195 -4.1,-30.15; 196 4.1,-30.45; 197 -4.1,-30.75; 198 4.1,-31.05; 199 -4.1,-31.35; 200 4.1,-31.65 | smd 4.6 x 4.5: P1 12,32.55; P2 12,-32.55 | hole 1.6: 0,33.4 | hole 1.1: 0,-33.4
HC49UP = smd 5.334 x 1.93: 1 -4.826,0; 2 4.826,0
R0805 = smd 1.1 x 1.4: 1 -1,0; 2 1,0
R0805' = smd 1.3 x 1.5: 1 -0.95,0; 2 0.95,0
DWP20_3P81X2P79-L = smd 1.676 x 0.508: 1 -4.636,5.715; 2 -4.636,4.445; 3 -4.636,3.175; 4 -4.636,1.905; 5 -4.636,0.635; 6 -4.636,-0.635; 7 -4.636,-1.905; 8 -4.636,-3.175; 9 -4.636,-4.445; 10 -4.636,-5.715; 11 4.636,-5.715; 12 4.636,-4.445; 13 4.636,-3.175; 14 4.636,-1.905; 15 4.636,-0.635; 16 4.636,0.635; 17 4.636,1.905; 18 4.636,3.175; 19 4.636,4.445; 20 4.636,5.715 | smd 2.79 x 3.81: EPAD 0,0
TSSOP-20_FE/CA = smd 1.473 x 0.356: 1 -2.819,2.926; 2 -2.819,2.276; 3 -2.819,1.626; 4 -2.819,0.975; 5 -2.819,0.325; 6 -2.819,-0.325; 7 -2.819,-0.975; 8 -2.819,-1.626; 9 -2.819,-2.276; 10 -2.819,-2.926; 11 2.819,-2.926; 12 2.819,-2.276; 13 2.819,-1.626; 14 2.819,-0.975; 15 2.819,-0.325; 16 2.819,0.325; 17 2.819,0.975; 18 2.819,1.626; 19 2.819,2.276; 20 2.819,2.926
IND_10040 = smd 2.5 x 3.2: 1 -4.05,0; 2 4.05,0
PAK100/2500-20 = drill 1 pad 1.422: 1 -11.43,-1.27; 2 -11.43,1.27; 3 -8.89,-1.27; 4 -8.89,1.27; 5 -6.35,-1.27; 6 -6.35,1.27; 7 -3.81,-1.27; 8 -3.81,1.27; 9 -1.27,-1.27; 10 -1.27,1.27; 11 1.27,-1.27; 12 1.27,1.27; 13 3.81,-1.27; 14 3.81,1.27; 15 6.35,-1.27; 16 6.35,1.27; 17 8.89,-1.27; 18 8.89,1.27; 19 11.43,-1.27; 20 11.43,1.27

### Placement (x,y rotation side)
C1  59.01,57.86 270 bottom
C2  61.81,57.86 270 bottom
C3  70.95,59 270 bottom
C4  73.72,59 90 bottom
C5  100nF  [C0805']  77.98,75.95 90 bottom
C6  100nF  [C0805']  77.98,80.14 90 bottom
C7  100nF  [C0805']  61,68.2 270 bottom
C8  100nF  [C0805']  61.59,82.23 180 bottom
C9  [C0805']  69.63,82.23 180 bottom
C10  100nF  [C0805']  61,78.49 90 bottom
C11  100nF  [C0805']  77.98,67.56 270 bottom
C12  100nF  [C0805']  65.91,65.66 0 bottom
C13  100nF  [C0805']  69.84,65.66 0 bottom
C14  100nF  [C0805']  61,73.34 270 bottom
C15  100nF  [C0805']  77.98,71.75 90 bottom
C16  82.55,81.41 270 bottom
C17  65.61,82.23 180 bottom
C18  680pF  [C0805']  69.15,20.95 180 bottom
C19  12pF  [C0805']  69.15,17.14 180 bottom
C20  47pF  [C0805']  73.28,26.8 270 bottom
C21  55.12,7.21 90 top
C22  49.4,37.92 0 bottom
C23  100nF  [C0805']  30.14,76.58 90 bottom
C24  1uF  [C0805']  24.26,76.58 90 bottom
C25  1uF  [C0805']  41.91,76.58 90 bottom
C26  100nF  [C0805']  36.03,76.58 90 bottom
C27  1uF  [C0805']  30.14,81.53 90 bottom
C28  100nF  [C0805']  36.03,81.53 90 bottom
C29  1uF  [C0805']  41.91,81.53 90 bottom
C30  100nF  [C0805']  24.26,81.53 90 bottom
C31  1uF  [C0805']  30.14,71.69 90 bottom
C32  100nF  [C0805']  36.03,71.69 90 bottom
C33  1uF  [C0805']  41.91,71.69 90 bottom
C34  100nF  [C0805']  24.26,71.69 90 bottom
C35  49.4,44.73 0 bottom
C36  49.4,31.11 0 bottom
C37  100nF  [C0805']  49.63,48.13 180 bottom
C38  100nF  [C0805']  49.63,34.52 0 bottom
C39  100nF  [C0805']  49.63,41.33 180 bottom
C40  70.74,7.21 270 top
C41  100nF  [C0805']  74.04,82.23 180 bottom
C42  100nF  [C0805']  78.99,95.38 90 bottom
DRILEGEND  [DRILEGEND]  15.14,-42.1 0 top  (outside the outline)
FERRITE_BEAD  74.04,65.66 180 bottom
IC1  69.52,74.08 90 top
J1  84.58,6.48 90 top
J2  84.45,95.63 0 top
J3  38.1,5.08 0 top
LOW_FREQ_OSC  60.41,58.9 0 top
P1  33.19,47.5 180 top
Q1  72.14,58.17 0 top
R1  79.25,57.91 0 bottom
R2  24.26,66.67 270 bottom
R3  47.5,74.8 90 top
R4  887k  [R0805']  69.15,27.79 180 bottom
R5  121k  [R0805']  77.44,26.8 270 bottom
R6  49.9k  [R0805']  64.64,18.92 270 bottom
R7  6.49k  [R0805']  69.15,24.89 180 bottom
R8  90.9k  [R0805']  76.45,16.89 0 bottom
R9  1k  [R0805']  76.45,21.34 180 bottom
U1  60.2,39.88 0 top
U$1  62.93,6.99 90 top
U$2  53.34,20.07 0 top
X1  92.06,50.07 90 top

### Tracks (layer width: path | path; a pad name or v marks a point on that pad's centre or on a via)
1.8V  (via drill 0.35)  (5 unrouted)
  Top 0.203: v53.59,36.58 55.44,36.58 U1.8
  Bottom 0.203: C34.1 C31.1 C32.1 C33.1 | C36.1 50.58,31.32 C38.1 52.64,36.58 v53.59,36.58 53.59,33.92 C36.1
5VIN  (4 unrouted)
  Top 0.203: J1.VIN0 75.56,6.48 73.44,8.6 C40.1 65.24,8.6 63.25,6.6 U$1.6
  Bottom 0.203: C22.1 50.79,41.12 C39.2
5VOUT  (via drill 0.35)  (7 unrouted)
  Top 0.203: C21.1 60.21,5.83 60.65,5.39 U$1.2 U$1.3 61.21,4.25 v61.21,5.59
  Bottom 0.203: R4.1 R7.1 68.2,22.71 69.11,21.81 69.11,13.48 v61.21,5.59 | C29.1 C28.1 35.23,80.58 33.88,79.23 32.49,79.23 31.14,80.58 C27.1 C30.1
FT_PD  (1 unrouted)
GND  (via drill 0.35)  (71 unrouted)
  Top 0.203: v59.94,2.29 60,2.34 U$1.1 60,3.5 60.2,3.3 60.24,3.3 60.37,3.17 63.54,3.17 63.69,3.32 63.69,3.95 U$1.7 64.12,3.95 64.12,3.32 64.27,3.17 65.49,3.17 65.64,3.32 65.64,3.95 U$1.10 66.04,3.98 v66.04,2.03 | v59.94,11.68 60,11.63 U$1.20 | v55.12,10.92 C21.2 52.11,8.6 v52.07,8.64 | C40.2 70.74,3.68 v70.61,3.56 87.36,3.56 J1.GND J1.P$4 90.28,15.38 v90.17,15.49 | v68.83,67.69 68.27,67.13 IC1.16 | v75.31,69.72 75.31,69.34 78.83,65.83 IC1.38 | v75.31,73.28 76.26,72.33 IC1.51 | v75.31,76.83 77.98,76.83 78.47,77.33 IC1.61 | v74.99,80.46 74.99,81.98 73.27,83.7 IC1.83 | v70.99,80.39 67.77,83.61 IC1.94 | v62.87,80.39 61.27,81.99 IC1.107 | v62.87,78.36 61.34,78.36 60.2,77.22 59.64,77.22 59.62,77.23 58.88,77.23 IC1.120 | v62.87,74.3 62.99,74.3 61.02,72.33 IC1.130 | v26.67,64.64 28.98,64.64 P1.152
  Bottom 0.203: v59.94,2.29 v59.94,11.68 57.4,11.68 56.64,10.92 v55.12,10.92 | v52.07,8.64 44.7,1.27 35.31,1.27 34.29,2.29 J3.4 | v70.61,3.56 67.56,3.56 v66.04,2.03 | R5.2 77.44,21.38 R9.2 R8.1 88.77,16.89 v90.17,15.49 | C36.2 48.02,33.86 C38.2 48.02,35.18 C22.2 48.02,40.66 C39.1 48.02,41.99 C35.2 48.02,47.47 C37.1 | C13.2 68.89,67.63 v68.83,67.69 | C11.2 75.31,69.28 v75.31,69.72 | C15.1 75.5,73.28 v75.31,73.28 | C5.1 76.14,76.83 v75.31,76.83 | C6.1 76.26,79.19 v74.99,80.46 C41.2 | C9.2 70.58,80.81 v70.99,80.39 | C17.2 66.56,80.76 v66.93,80.39 | C8.2 62.55,80.71 v62.87,80.39 | C10.2 62.08,78.36 v62.87,78.36 | C14.1 v62.86,74.29 | v62.86,74.29 v62.87,74.3 | v62.86,74.29 62.86,73.16 63.5,72.53 63.5,71.64 C7.1 | C33.2 C32.2 C31.2 C34.2 | C24.2 C23.2 C26.2 C25.2 | C30.2 C27.2 32.41,82.48 32.49,82.57 33.88,82.57 33.96,82.48 C28.2 C29.2 | R2.2 25.29,64.64 v26.67,64.64
  pour Top (isolate 0.305, rank 5): 0,101.6 99.82,101.6 99.82,0 0,0
N$1  (1 unrouted)
N$2  (via drill 0.35)
  Top 0.203: v64.9,80.39 61.77,83.52 IC1.106
  Bottom 0.203: C17.1 64.66,80.63 v64.9,80.39
N$3
  Bottom 0.203: R7.2 72.32,24.89 C20.2
N$4  (via drill 0.35)
  Top 0.203: v65.02,11.94 65.2,11.76 U$1.12
  Bottom 0.203: v65.02,11.94 64.64,12.32 R6.2 65.47,17.14 C19.1
N$5
  Bottom 0.203: R6.1 65.72,20.95 C18.1
N$6  (via drill 0.35)
  Top 0.203: v71.63,23.88 v71.63,26.42 | v70.1,15.49 68.33,13.72 65.02,13.72 64.26,12.95 64.26,11.43 64.55,11.14 U$1.13
  Bottom 0.203: R5.1 C20.1 73.24,27.79 R4.2 70.26,27.79 v71.63,26.42 | v71.63,23.88 71.63,22.48 C18.2 C19.2 v70.1,15.5 v70.1,15.49
N$7  (2 unrouted)
  Top 0.203: U$2.2 63.25,14.2 U$1.15
  pour Top (isolate 0.305): 56.01,22.35 56.01,18.29 55.88,22.48
  pour Top (isolate 0.305, rank 2): 58.93,25.4 53.72,25.4 53.59,25.27 53.59,14.73 58.93,14.73
N$8  (1 unrouted)
  Top 0.203: U$1.18 61.3,12.61 59.44,14.48 51.82,14.48 49.29,17 U$2.1
  pour Top (isolate 0.305, rank 2): 50.55,21.72 48.01,21.72 48.13,21.59
  pour Top (isolate 0.305, rank 3): 47.5,25.4 53.34,25.4 53.34,14.73 47.37,14.73 47.37,25.27
N$9  (via drill 0.35)
  Top 0.203: v65.28,6.1 65.28,4.24 U$1.9
  Bottom 0.203: R8.2 65.28,6.67 v65.28,6.1
N$10  (via drill 0.35)
  Top 0.203: v64.26,6.1 64.26,5.59 64.55,5.3 U$1.8
  Bottom 0.203: R9.1 74.17,20 74.17,16.06 64.26,6.15 v64.26,6.1
OSC32_IN  (2 unrouted)
OSC32_OUT  (2 unrouted)
OSC_IN  (1 unrouted)
  Top 0.203: Q1.1 67.31,60.2 68.33,61.21 70.87,61.21 71.77,62.12 IC1.23
OSC_OUT  (1 unrouted)
  Top 0.203: IC1.24 72.27,62.1 73.15,61.21 76.2,61.21 76.96,60.45 Q1.2
QIO0
  Top 0.203: IC1.58 80.35,75.73 81.1,75.73 81.77,75.06 81.79,75.06 87.5,69.34 87.5,50.66 90.54,47.62 94.23,47.62 95.12,46.74 95.12,44.7 94.14,43.72 X1.5
QIO1  (1 unrouted)
QIO2
  Top 0.203: IC1.60 80.35,76.73 81.1,76.73 88.39,69.44 88.39,51.69 89.92,50.16 92.33,50.16 93.33,51.17 X1.11
QIO3
  Top 0.203: IC1.63 80.35,78.23 81.1,78.23 89.28,70.05 89.28,52.58 90.52,51.34 X1.12
QSPI_CS  (1 unrouted)
QSPICLK  (1 unrouted)
RESET  (1 unrouted)
RUN  (1 unrouted)
SENSOR_UART  (1 unrouted)
SWCLK  (via drill 0.35)  (1 unrouted)
  other vias: 83.19,96.27 83.19,96.27
SWDIO  (1 unrouted)
SWO
  Top 0.203: IC1.133 57.32,70.83 56.39,71.75 56.39,97.16 57.73,98.5 82.22,98.5 J2.6
UART5_RX  (1 unrouted)
UART5_TX  (via drill 0.35)  (1 unrouted)
  Top 0.203: IC1.113 58.73,80.77 v57.15,80.77
USB_OTGID  (via drill 0.35)
  Top 0.203: v26.8,69.47 29.01,69.47 P1.168
  Bottom 0.203: R2.1 26.05,69.47 v26.8,69.47
VDD  (via drill 0.35)  (22 unrouted)
  Top 0.203: v52.83,44.7 52.83,42.67 53.72,41.78 U1.4 | v70.74,67.69 68.77,65.72 IC1.17 | v72.77,67.69 75.27,65.19 IC1.30 | v75.31,71.5 75.31,70.62 75.94,69.98 75.94,69.22 78.87,66.29 78.9,66.33 IC1.39 | v75.31,75.06 77.54,72.83 IC1.52 | v75.31,78.61 76.1,77.83 IC1.62 | v78.11,82.8 78.13,82.83 IC1.72 | v73.03,80.39 72.77,80.65 IC1.84 | v68.96,80.39 67.27,82.08 IC1.95 | v58.8,84.71 60.66,84.71 IC1.108 | v62.87,76.33 62.37,76.83 IC1.121 | v62.87,72.26 62.43,71.83 IC1.131 | v58.93,63.5 58.93,65.18 IC1.144
  Bottom 0.203: C37.2 50.58,44.94 C35.1 50.81,44.7 v52.83,44.7 | C13.1 70.79,67.64 v70.74,67.69 | FERRITE_BEAD.1 72.74,67.66 v72.77,67.69 | C11.1 75.31,71.18 v75.31,71.5 | C15.2 75.63,75.06 v75.31,75.06 | C5.2 76.26,78.61 v75.31,78.61 | C6.2 78.11,81.21 v78.11,82.8 | C41.1 73.09,80.46 v73.03,80.39 | C9.1 68.68,80.67 v68.96,80.39 | C8.1 60.65,82.86 v58.8,84.71 | C10.1 61.66,77.54 v62.87,76.33 | C14.2 61.13,72.26 v62.87,72.26 | C7.2 61,65.57 v58.93,63.5 | C25.1 C26.1 C23.1 C24.1
VDDA  (via drill 0.35)  (1 unrouted)
  Top 0.203: v75.31,67.69 75.82,67.18 75.82,65.15 76.77,64.2 IC1.33
  Bottom 0.203: FERRITE_BEAD.2 75.34,67.66 v75.31,67.69
VREF  (1 unrouted)